# EAGLE design BM83_board (EAGLE 9.6.2)
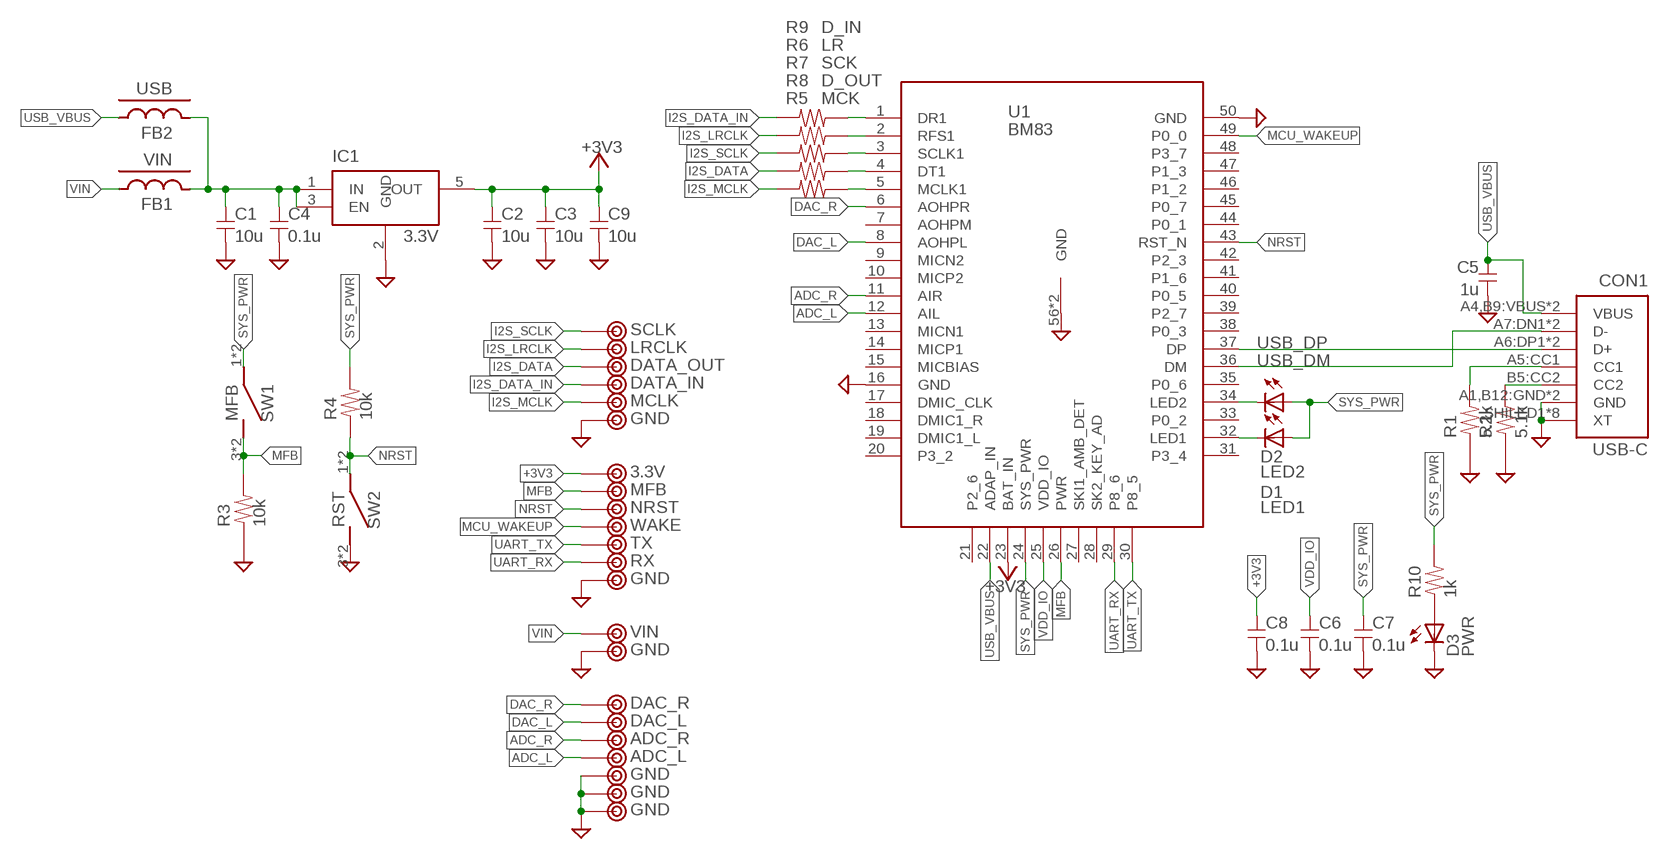
[diagram p0: schematic, sheet 1]

## Parts
C1  10u  C-2012  [2012]
C2  10u  C-2012  [2012]
C3  10u  C-2012  [2012]
C4  0.1u  C-1608  [1608C]
C5  1u  C-1608  [1608C]
C6  0.1u  C-1608  [1608C]
C7  0.1u  C-1608  [1608C]
C8  0.1u  C-1608  [1608C]
C9  10u  C-2012  [2012]
CON1  USB-C  [5077CR-16-SMC2-BK-TR]
D1  LED1  LED-SMD1608  [D1608]
D2  LED2  LED-SMD1608  [D1608]
D3  PWR  LED-SMD1608  [D1608]
FB1  VIN  FB-1608FB  [1608-FB]
FB2  USB  FB-1608FB  [1608-FB]
IC1  3.3V  TLV740  [SOT23-5]
R1  5.1k  R-1608  [1608]
R2  5.1k  R-1608  [1608]
R3  10k  R-1608  [1608]
R4  10k  R-1608  [1608]
R5  MCK  R-1608-2  [1608-2]
R6  LR  R-1608-2  [1608-2]
R7  SCK  R-1608-2  [1608-2]
R8  D_OUT  R-1608-2  [1608-2]
R9  D_IN  R-1608-2  [1608-2]
R10  1k  R-1608  [1608]
SW1  MFB  SW-SMD  [SKRPACE010]
SW2  RST  SW-SMD  [SKRPACE010]
TP1  DAC_R  TESTPIN  [TESTPIN]
TP2  DAC_L  TESTPIN  [TESTPIN]
TP3  GND  TESTPIN  [TESTPIN]
TP4  SCLK  TESTPIN  [TESTPIN]
TP5  LRCLK  TESTPIN  [TESTPIN]
TP6  DATA_OUT  TESTPIN  [TESTPIN]
TP7  DATA_IN  TESTPIN  [TESTPIN]
TP8  MCLK  TESTPIN  [TESTPIN]
TP9  GND  TESTPIN  [TESTPIN]
TP10  3.3V  TESTPIN  [TESTPIN]
TP11  MFB  TESTPIN  [TESTPIN]
TP12  NRST  TESTPIN  [TESTPIN]
TP13  WAKE  TESTPIN  [TESTPIN]
TP14  TX  TESTPIN  [TESTPIN]
TP15  RX  TESTPIN  [TESTPIN]
TP16  GND  TESTPIN  [TESTPIN]
TP17  VIN  TESTPIN  [TESTPIN]
TP18  GND  TESTPIN  [TESTPIN]
TP19  ADC_R  TESTPIN  [TESTPIN]
TP20  ADC_L  TESTPIN  [TESTPIN]
TP21  GND  TESTPIN  [TESTPIN]
TP22  GND  TESTPIN  [TESTPIN]
U1  BM83  [BM83]

## Nets
+3V3: C2.1 C3.1 C8.1 C9.1 IC1.5(OUT) TP10.1 U1.23(BAT_IN)
ADC_L: TP20.1 U1.12(AIL)
ADC_R: TP19.1 U1.11(AIR)
DAC_L: TP2.1 U1.8(AOHPL)
DAC_R: TP1.1 U1.6(AOHPR)
GND: C1.2 C2.2 C3.2 C4.2 C5.2 C6.2 C7.2 C8.2 C9.2 CON1.A1,B12:GND(GND) CON1.B1,A12:GND(GND) CON1.SHILED1(XT) CON1.SHILED2(XT) CON1.SHILED3(XT) CON1.SHILED4(XT) CON1.SHILED5(XT) CON1.SHILED6(XT) CON1.SHILED7(XT) CON1.SHILED8(XT) D3.K IC1.2(GND) R1.1 R2.1 R3.1 SW2.3 SW2.4 TP3.1 TP9.1 TP16.1 TP18.1 TP21.1 TP22.1 U1.16(GND) U1.50(GND) U1.56(GND) U1.57(GND)
I2S_DATA: R8.1 TP6.1
I2S_DATA_IN: R9.1 TP7.1
I2S_LRCLK: R6.1 TP5.1
I2S_MCLK: R5.1 TP8.1
I2S_SCLK: R7.1 TP4.1
MCU_WAKEUP: TP13.1 U1.49(P0_0)
MFB: R3.2 SW1.3 SW1.4 TP11.1 U1.26(PWR)
N$1: CON1.B5:CC2(CC2) R2.2
N$2: CON1.A5:CC1(CC1) R1.2
N$3: R5.2 U1.5(MCLK1)
N$4: D2.K U1.34(LED2)
N$5: D1.K U1.32(LED1)
N$6: C1.1 C4.1 FB1.2 FB2.2 IC1.1(IN) IC1.3(EN)
N$7: D3.A R10.1
N$8: R8.2 U1.4(DT1)
N$9: R7.2 U1.3(SCLK1)
N$10: R6.2 U1.2(RFS1)
N$15: R9.2 U1.1(DR1)
NRST: R4.1 SW2.1 SW2.2 TP12.1 U1.43(RST_N)
SYS_PWR: C7.1 D1.A D2.A R4.2 R10.2 SW1.1 SW1.2 U1.24(SYS_PWR)
UART_RX: TP15.1 U1.29(P8_6)
UART_TX: TP14.1 U1.30(P8_5)
USB_DM: CON1.A7:DN1(D-) CON1.B7:DN2(D-) U1.36(DM)
USB_DP: CON1.A6:DP1(D+) CON1.B6:DP2(D+) U1.37(DP)
USB_VBUS: C5.1 CON1.A4,B9:VBUS(VBUS) CON1.B4,A9:VBUS(VBUS) FB2.1 U1.22(ADAP_IN)
VDD_IO: C6.1 U1.25(VDD_IO)
VIN: FB1.1 TP17.1
Unconnected: U1.7(AOHPM) U1.9(MICN2) U1.10(MICP2) U1.13(MICN1) U1.14(MICP1) U1.15(MICBIAS) U1.17(DMIC_CLK) U1.18(DMIC1_R) U1.19(DMIC1_L) U1.20(P3_2) U1.21(P2_6) U1.27(SKI1_AMB_DET) U1.28(SK2_KEY_AD) U1.31(P3_4) U1.33(P0_2) U1.35(P0_6) U1.38(P0_3) U1.39(P2_7) U1.40(P0_5) U1.41(P1_6) U1.42(P2_3) U1.44(P0_1) U1.45(P0_7) U1.46(P1_2) U1.47(P1_3) U1.48(P3_7)

## Library data of the parts
C1-C9 = my_rcl:C
CON1 = my_connector:USB-C
D1-D3 = my_rcl:LED
FB1 FB2 = my_rcl:FB
IC1 = my_ic:TLV740
R1-R10 = my_rcl:R
SW1 SW2 = my_rcl:SW
TP1-TP22 = my_connector:TESTPIN
U1 = my_ic:BM83

## Board
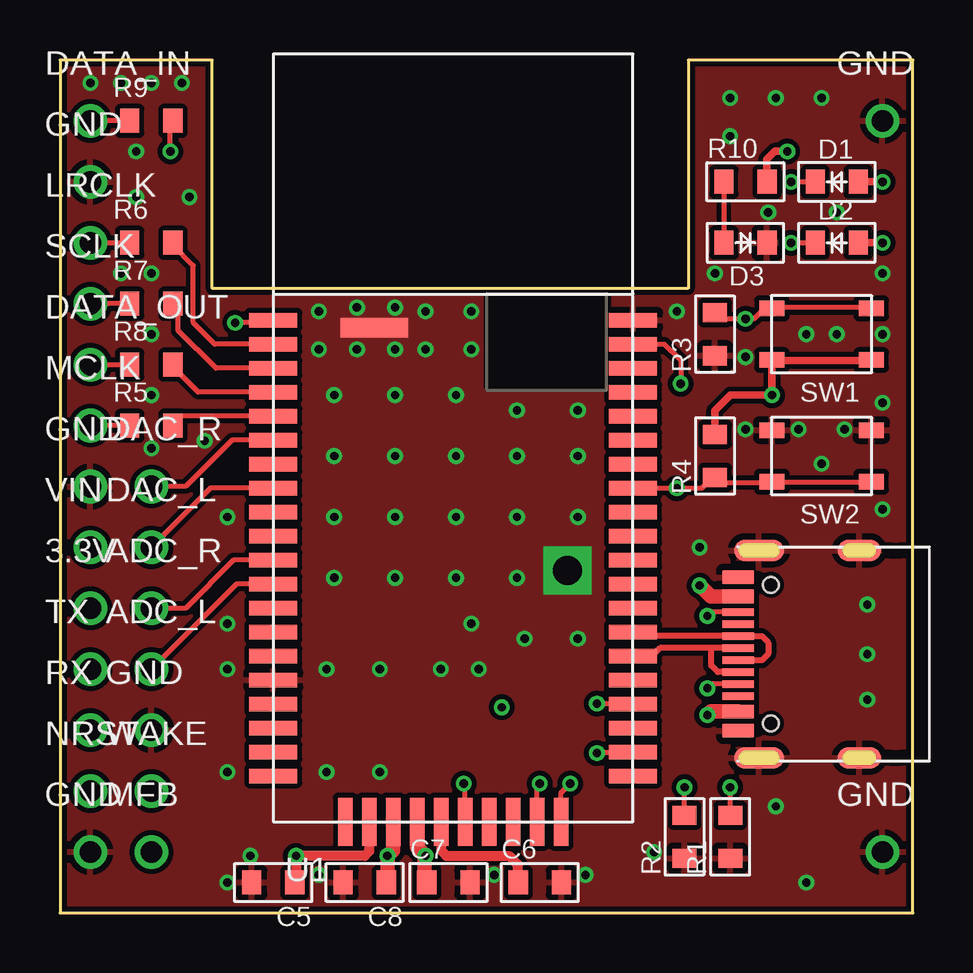
[diagram p1: board, top side]
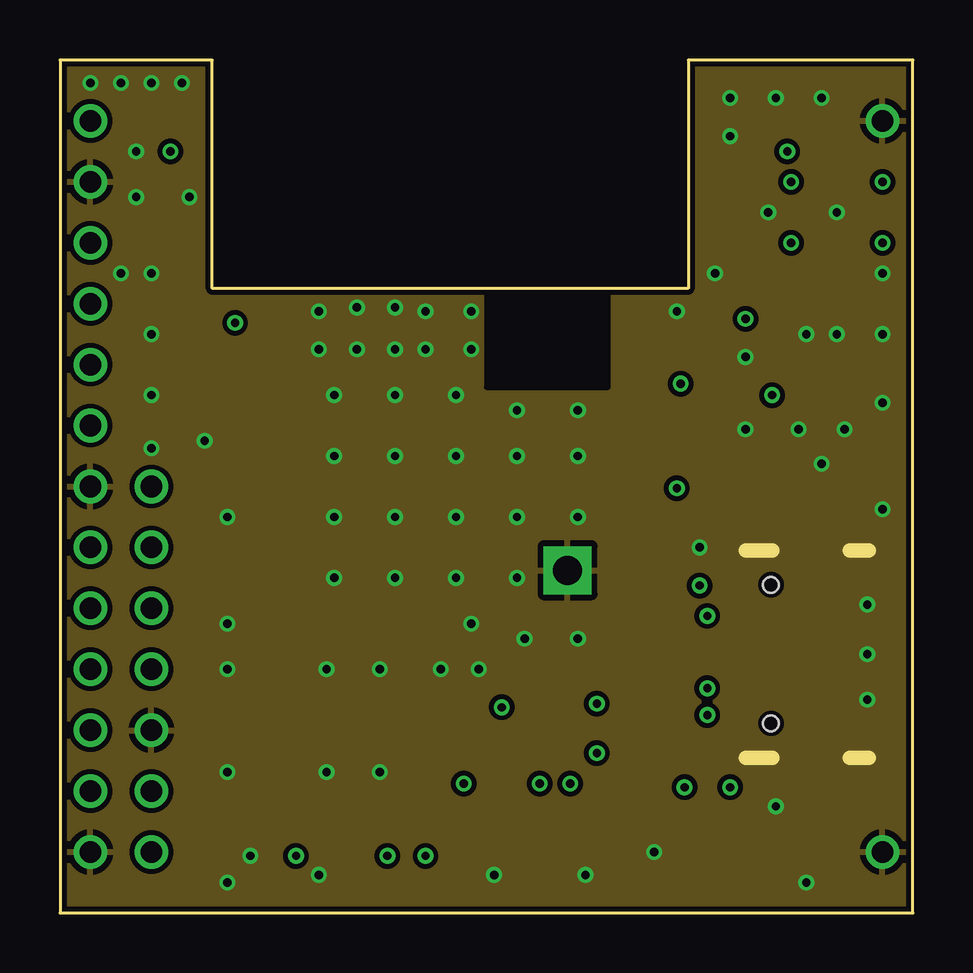
[diagram p2: board, inner layer Route2]
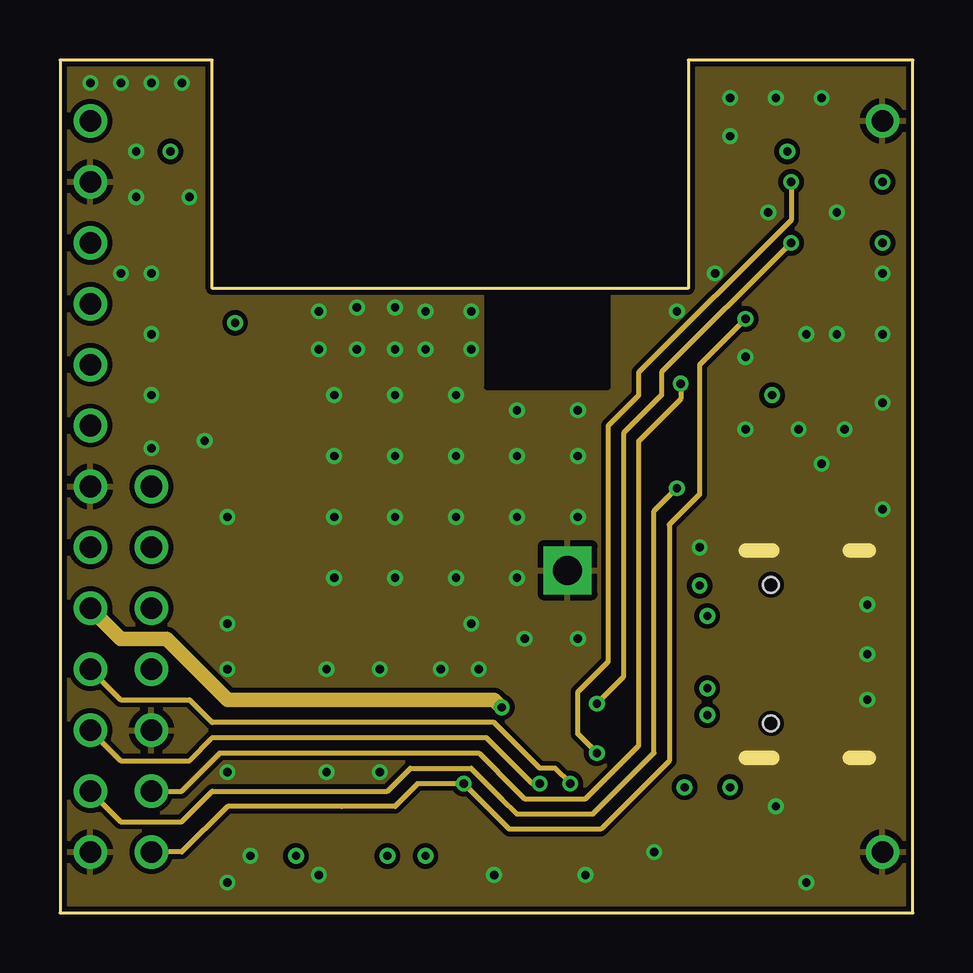
[diagram p3: board, inner layer Route15]
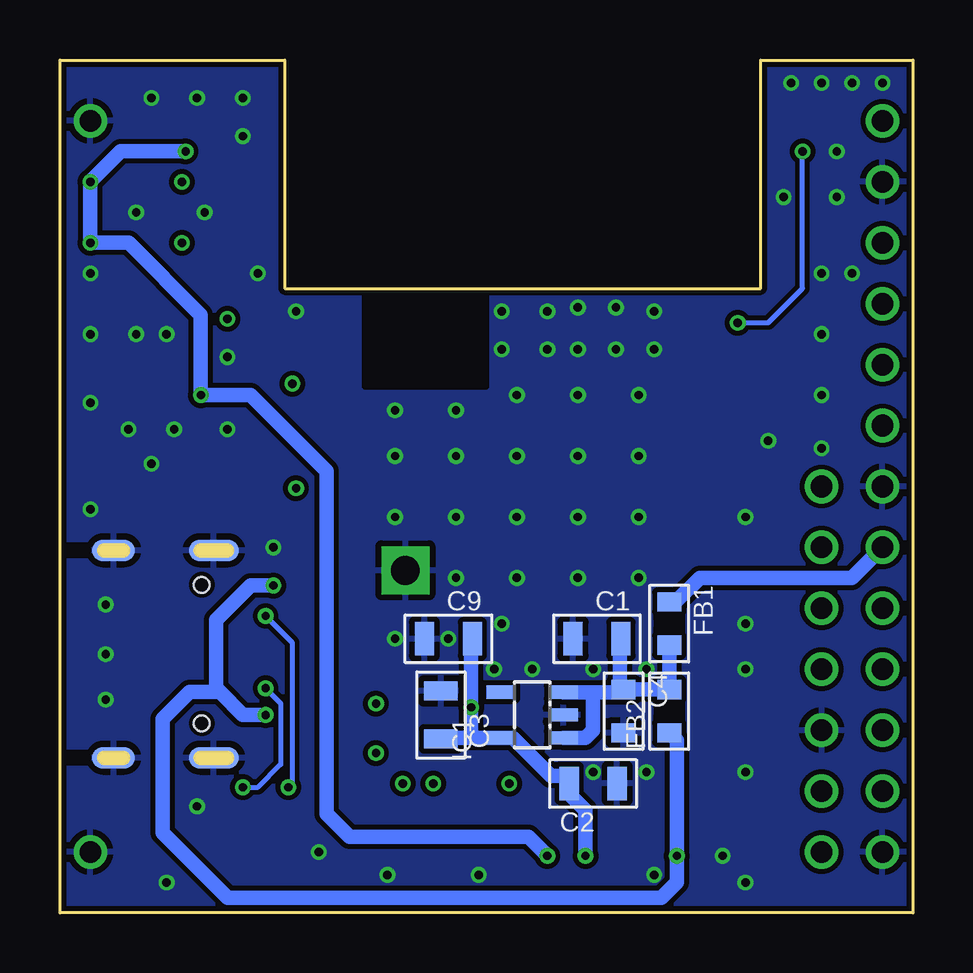
[diagram p4: board, bottom side, seen from below]

Size 35.56 x 35.56 mm. Coordinates in mm from the lower left corner, seen from the top.
Outline: 0,35.56 0,0 35.56,0 35.56,35.56 26.19,35.56 26.19,26.04 6.35,26.04 6.35,35.56 0,35.56
Copper layers (1*2*15*16): Top 0.035mm / dielectric 0.2mm / Route2 0.0175mm / dielectric 1.065mm / Route15 0.0175mm / dielectric 0.2mm / Bottom 0.035mm
Design rules "JLCPCB_4layer": minimum track width 6mil, minimum drill 0.3mm, track to track 6mil, track to pad 6mil, pad to pad 6mil, via to via 8mil, smd to smd 0mil, copper to edge 0.2mm, drill to drill 0.4mm, minimum pad ring 8mil, minimum via ring 6mil, stop-mask expansion 4mil, vias tented up to drill 1mm, thermal gap 10mil

### Footprints (pad centres in the part's own frame; a part is rotated, then mirrored left to right if it is on the bottom)
2012 = smd 0.8 x 1.4: 1 -1,0; 2 1,0
1608C = smd 0.8 x 1: 1 -0.9,0; 2 0.9,0
5077CR-16-SMC2-BK-TR = smd 0.6 x 1.34: A1,B12:GND -3.2,0.3; A4,B9:VBUS -2.4,0.3; B1,A12:GND 3.2,0.3; B4,A9:VBUS 2.4,0.3 | smd 0.3 x 1.34: A5:CC1 -1.25,0.3; A6:DP1 -0.25,0.3; A7:DN1 0.25,0.3; A8:SBU1 1.25,0.3; B5:CC2 1.75,0.3; B6:DP2 0.75,0.3; B7:DN2 -0.75,0.3; B8:SBU2 -1.75,0.3 | smd 0.9 x 2.1: SHILED1 -4.32,-0.57; SHILED2 4.32,-0.57 | smd 0.9 x 1.8: SHILED3 -4.32,-4.75; SHILED4 4.32,-4.75 | smd 0.9 x 2.1 bottom: SHILED5 -4.32,-0.57; SHILED7 4.32,-0.57 | smd 0.9 x 1.8 bottom: SHILED6 -4.32,-4.75; SHILED8 4.32,-4.75 | hole 0.65: -2.89,-1.07; 2.89,-1.07
D1608 = smd 0.8 x 1: A 0.9,0; K -0.9,0
1608-FB = smd 0.8 x 1: 1 -0.9,0; 2 0.9,0
SOT23-5 = smd 0.55 x 1.2: 1 -0.95,-1.3; 2 0,-1.3; 3 0.95,-1.3; 4 0.95,1.3; 5 -0.95,1.3
1608 = smd 0.8 x 1: 1 -0.9,0; 2 0.9,0
1608-2 = smd 0.8 x 1: 1 -0.9,0; 2 0.9,0
SKRPACE010 = smd 1.05 x 0.65: 1 -2.075,1.075; 2 2.075,1.075; 3 -2.075,-1.075; 4 2.075,-1.075
TESTPIN = drill 0.9 pad 1.4: 1 0,0
BM83 = smd 2 x 0.6: 1 0,20.9; 2 0,19.9; 3 0,18.9; 4 0,17.9; 5 0,16.9; 6 0,15.9; 7 0,14.9; 8 0,13.9; 9 0,12.9; 10 0,11.9; 11 0,10.9; 12 0,9.9; 13 0,8.9; 14 0,7.9; 15 0,6.9; 16 0,5.9; 17 0,4.9; 18 0,3.9; 19 0,2.9; 20 0,1.9; 31 15,1.9; 32 15,2.9; 33 15,3.9; 34 15,4.9; 35 15,5.9; 36 15,6.9; 37 15,7.9; 38 15,8.9; 39 15,9.9; 40 15,10.9; 41 15,11.9; 42 15,12.9; 43 15,13.9; 44 15,14.9; 45 15,15.9; 46 15,16.9; 47 15,17.9; 48 15,18.9; 49 15,19.9; 50 15,20.9 | smd 0.6 x 2: 21 3,0; 22 4,0; 23 5,0; 24 6,0; 25 7,0; 26 8,0; 27 9,0; 28 10,0; 29 11,0; 30 12,0 | drill 1.2 pad 2 square: 56 12.27,10.47 | smd 2.8 x 0.8: 57 4.21,20.58

### Placement (x,y rotation side)
C1  13.18,11.43 180 bottom
C2  13.33,5.4 0 bottom
C3  19.68,8.26 90 bottom
C4  12.06,8.41 270 bottom
C5  8.89,1.27 180 top
C6  20,1.27 0 top
C7  16.19,1.27 0 top
C8  12.7,1.27 180 top
C9  19.37,11.43 180 bottom
CON1  28.57,10.79 90 top
D1  32.38,30.48 0 top
D2  32.38,27.94 0 top
D3  28.57,27.94 180 top
FB1  10.16,12.06 270 bottom
FB2  10.16,8.41 90 bottom
IC1  15.88,8.26 90 bottom
R1  27.94,3.17 90 top
R2  26.04,3.17 90 top
R3  27.3,24.13 90 top
R4  27.3,19.05 90 top
R5  3.81,20.32 0 top
R6  3.81,27.94 0 top
R7  3.81,25.4 0 top
R8  3.81,22.86 0 top
R9  3.81,33.02 0 top
R10  28.57,30.48 0 top
SW1  31.75,24.13 180 top
SW2  31.75,19.05 180 top
TP1  3.81,17.78 0 top
TP2  3.81,15.24 0 top
TP3  34.29,2.54 0 top
TP4  1.27,25.4 0 top
TP5  1.27,27.94 0 top
TP6  1.27,22.86 0 top
TP7  1.27,33.02 0 top
TP8  1.27,20.32 0 top
TP9  1.27,17.78 0 top
TP10  1.27,12.7 0 top
TP11  3.81,2.54 0 top
TP12  1.27,5.08 0 top
TP13  3.81,5.08 0 top
TP14  1.27,10.16 0 top
TP15  1.27,7.62 0 top
TP16  1.27,2.54 0 top
TP17  1.27,15.24 0 top
TP18  1.27,30.48 0 top
TP19  3.81,12.7 0 top
TP20  3.81,10.16 0 top
TP21  34.29,33.02 0 top
TP22  3.81,7.62 0 top
U1  8.89,3.81 0 top

### Tracks (layer width: path | path; a pad name or v marks a point on that pad's centre or on a via)
+3V3  (via drill 0.35)
  Top 0.61: U1.23 13.89,2.62 v13.65,2.38 13.65,1.32 C8.1
  Route15 0.61: TP10.1 2.54,11.43 4.45,11.43 6.98,8.89 18.1,8.89 v18.41,8.57
  Bottom 0.61: 18.41,7.3 IC1.5 16.67,7.3 15.08,5.71 14.33,5.71 C2.1 14.33,4.97 13.65,4.29 v13.65,2.38 | C9.1 18.41,11.38 v18.41,8.57 18.41,7.3 | C3.1 19.63,7.3 18.41,7.3
ADC_L
  Top 0.203: U1.12 7.36,13.71 TP20.1
ADC_R
  Top 0.203: U1.11 7.25,14.71 5.24,12.7 TP19.1
DAC_L
  Top 0.203: U1.8 6.28,17.71 TP2.1
DAC_R
  Top 0.203: U1.6 7.17,19.71 5.24,17.78 TP1.1
GND  (via drill 0.35)
  other vias: 12.38,23.5 13.97,23.5 17.14,23.5 16.51,21.59 13.97,21.59 11.43,21.59 11.43,19.05 13.97,19.05 16.51,19.05 19.05,19.05 21.59,19.05 21.59,16.51 19.05,16.51 16.51,16.51 13.97,16.51 11.43,16.51 11.43,13.97 13.97,13.97 16.51,13.97 19.05,13.97 17.46,10.16 19.37,11.43 21.59,11.43 19.05,20.95 13.33,10.16 15.88,10.16 11.11,5.87 6.98,1.27 7.94,2.38 21.91,1.59 6.98,5.87 24.77,2.54 18.1,1.59 10.79,1.59 13.33,5.87 29.84,4.45 31.11,1.27 1.27,34.61 2.54,34.61 3.81,34.61 5.08,34.61 3.17,31.75 3.17,29.84 5.4,29.84 2.54,26.67 25.72,25.08 28.57,23.18 28.57,20.16 30.8,20.16 32.7,20.16 31.11,24.13 32.38,24.13 31.75,18.73 34.29,21.27 29.53,29.21 32.38,29.21 27.94,33.97 29.84,33.97 31.75,33.97 27.94,32.38 27.3,26.67 21.59,20.95 6.98,12.06 6.98,16.51 6.03,19.68 3.81,26.67 3.81,24.13 3.81,21.59 3.81,19.37 6.98,10.16 11.11,10.16 26.67,15.24 17.14,12.06 15.24,23.5 10.79,25.08 17.14,25.08 15.24,25.08 10.79,23.5 13.97,25.24 12.38,25.24 33.66,8.89 33.66,10.79 33.66,12.86 34.29,24.13 34.29,26.67 34.29,16.83
  pour Route15 (isolate 0.203): 0,35.56 0,0 35.56,0 35.56,35.56
  pour Top (isolate 0.203): 0,35.56 0,0 35.56,0 35.56,35.56
  pour Route2 (isolate 0.203): 0,35.56 0,0 35.56,0 35.56,35.56
  pour Bottom (isolate 0.203): 0,35.56 0,0 35.56,0 35.56,35.56
  cutout Top (isolate 0.203): 22.86,26.04 22.86,21.91 17.78,21.91 17.78,26.04
  cutout Route2 (isolate 0.203): 17.78,26.04 17.78,21.91 22.86,21.91 22.86,26.04
  cutout Route15 (isolate 0.203): 17.78,26.04 17.78,21.91 22.86,21.91 22.86,26.04
  cutout Bottom (isolate 0.203): 17.78,26.04 17.78,21.91 22.86,21.91 22.86,26.04
  pour Top (isolate 0.203, no thermals): 10.64,25.4 10.64,12.06 22.86,12.06 22.86,25.4
I2S_DATA
  Top 0.203: TP6.1 R8.1
I2S_DATA_IN
  Top 0.203: R9.1 TP7.1
I2S_LRCLK
  Top 0.203: TP5.1 R6.1
I2S_MCLK
  Top 0.203: R5.1 TP8.1
I2S_SCLK
  Top 0.203: R7.1 TP4.1
MCU_WAKEUP  (via drill 0.35)
  Top 0.203: U1.49 25.18,23.71 25.88,23.02 v25.88,22.07
  Route15 0.203: TP13.1 5.08,5.08 6.67,6.67 15.56,6.67 17.46,6.67 19.05,5.08 19.37,4.76 21.91,4.76 24.13,6.99 24.13,19.68 25.88,21.43 v25.88,22.07
MFB  (via drill 0.35)
  Top 0.203: U1.26 16.89,5.33 v16.83,5.4 | SW1.3 33.79,25.24 29.71,25.24 SW1.4 29.36,25.2 28.92,24.77 v28.57,24.77 27.57,24.77 R3.2
  Route15 0.203: TP11.1 5.08,2.54 6.98,4.45 11.75,4.45 13.97,4.45 14.92,5.4 v16.83,5.4 18.73,3.49 22.54,3.49 25.4,6.35 25.4,16.19 26.67,17.46 26.67,22.86 v28.57,24.77
N$1  (via drill 0.35)
  Top 0.203: CON1.B5:CC2 27.15,12.54 v26.99,12.38 | R2.2 v26.04,5.24
  Bottom 0.203: v26.04,5.24 25.88,5.4 25.88,11.27 v26.99,12.38
N$2  (via drill 0.35)
  Top 0.203: CON1.A5:CC1 27.17,9.54 v26.99,9.37 | R1.2 v27.94,5.24
  Bottom 0.203: v27.94,5.24 27.3,5.24 26.35,6.19 26.35,8.73 v26.99,9.37
N$3
  Top 0.203: U1.5 4.71,20.71 R5.2
N$4  (via drill 0.35)
  Top 0.203: v22.38,8.73 23.87,8.73 U1.34 | v30.48,27.94 30.85,27.94 D2.K
  Route15 0.203: v22.38,8.73 23.5,9.84 23.5,20 25.08,21.59 25.08,22.54 v30.48,27.94
N$5  (via drill 0.35)
  Top 0.203: U1.32 23.85,6.67 v22.38,6.67 | v30.48,30.48 D1.K
  Route15 0.203: v22.38,6.67 21.59,7.46 21.59,9.21 22.86,10.48 22.86,20.32 23.57,21.03 24.13,21.59 24.13,22.54 30.48,28.89 v30.48,30.48
N$6
  Bottom 0.61: IC1.3 13.33,9.21 | 13.33,9.21 12.17,9.21 C4.1 | FB1.2 FB2.2 C4.1 | C4.1 12.22,9.47 12.22,11.38 C1.1 | IC1.1 13.65,7.3 13.33,7.62 13.33,9.21
N$7
  Top 0.203: R10.1 D3.A
N$8
  Top 0.203: U1.4 5.75,21.71 4.71,22.75 R8.2
N$9
  Top 0.203: U1.3 6.5,22.71 4.92,24.29 4.92,25.08 4.71,25.29 R7.2
N$10
  Top 0.203: U1.2 6.45,23.71 5.56,24.61 5.56,26.99 4.71,27.83 R6.2
N$15  (via drill 0.35)
  Top 0.203: R9.2 4.71,32.86 4.6,32.76 v4.6,31.75 | U1.1 8.79,24.61 v7.3,24.61
  Bottom 0.203: v7.3,24.61 6.03,24.61 4.6,26.04 v4.6,31.75
NRST  (via drill 0.35)
  Top 0.203: U1.43 v25.72,17.71 26.76,17.71 27.2,18.15 R4.1 27.52,17.94 29.64,17.94 | 29.64,17.94 SW2.2 | SW2.1 33.79,17.94 29.64,17.94
  Route15 0.203: TP12.1 2.54,3.81 5.08,3.81 6.35,5.08 13.65,5.08 14.61,6.03 17.14,6.03 18.41,4.76 19.05,4.13 22.22,4.13 24.77,6.67 24.77,16.76 v25.72,17.71
SYS_PWR  (via drill 0.35)
  Top 0.305: SW1.1 33.79,23.02 29.71,23.02 SW1.2 v29.69,21.59 27.94,21.59 27.3,20.95 R4.2 | v34.29,30.48 D1.A | D2.A v34.29,27.94 | v30.32,31.75 29.79,31.75 29.47,31.43 R10.2
  Top 0.61: U1.24 14.89,2.73 v15.24,2.38 15.21,2.35 15.21,1.35 C7.1
  Bottom 0.61: v15.24,2.38 16.03,3.17 23.5,3.17 24.45,4.13 24.45,18.41 27.62,21.59 v29.69,21.59 29.69,24.92 32.7,27.94 v34.29,27.94 v34.29,30.48 33.02,31.75 v30.32,31.75
UART_RX  (via drill 0.35)
  Top 0.203: U1.29 19.89,5.29 v20,5.4
  Route15 0.203: v20,5.4 19.68,5.4 17.78,7.3 6.35,7.3 5.4,6.35 2.54,6.35 TP15.1
UART_TX  (via drill 0.35)
  Top 0.203: U1.30 20.89,5.01 v21.27,5.4
  Route15 0.203: v21.27,5.4 20.64,6.03 20,6.03 18.1,7.94 6.35,7.94 5.4,8.89 2.54,8.89 TP14.1
USB_DM
  Top 0.254: CON1.A7:DN1 27.15,11.04 | 27.15,11.04 25.02,11.04 24.68,10.71 U1.36 | CON1.B7:DN2 27.42,10.04 27.15,10.32 27.15,11.04
USB_DP
  Top 0.254: U1.37 24.33,11.71 24.49,11.54 CON1.B6:DP2 29.25,11.54 29.53,11.27 29.53,10.79 29.28,10.54 CON1.A6:DP1
USB_VBUS  (via drill 0.35)
  Top 0.406: C5.1 9.84,1.32 v9.84,2.38 12.7,2.38 12.89,2.57 U1.22
  Top 0.61: CON1.B4,A9:VBUS 27.13,13.2 v26.67,13.65 | CON1.A4,B9:VBUS 27.13,8.39 v26.99,8.26
  Bottom 0.61: FB2.1 9.84,7.2 v9.84,2.38 9.84,1.27 10.48,0.64 28.57,0.64 31.27,3.33 31.27,7.78 31.27,8.1 30.16,9.21 28.89,9.21 | v26.99,8.26 27.94,8.26 28.89,9.21 | 28.89,9.21 29.05,9.37 29.05,12.22 27.62,13.65 v26.67,13.65
VDD_IO
  Top 0.406: C6.1 19.1,2.01 18.73,2.38 16.11,2.38 15.89,2.6 U1.25
VIN
  Bottom 0.61: TP17.1 2.54,13.97 8.89,13.97 9.89,12.96 FB1.1